# EAGLE design conv_smd_new (EAGLE 6.1)
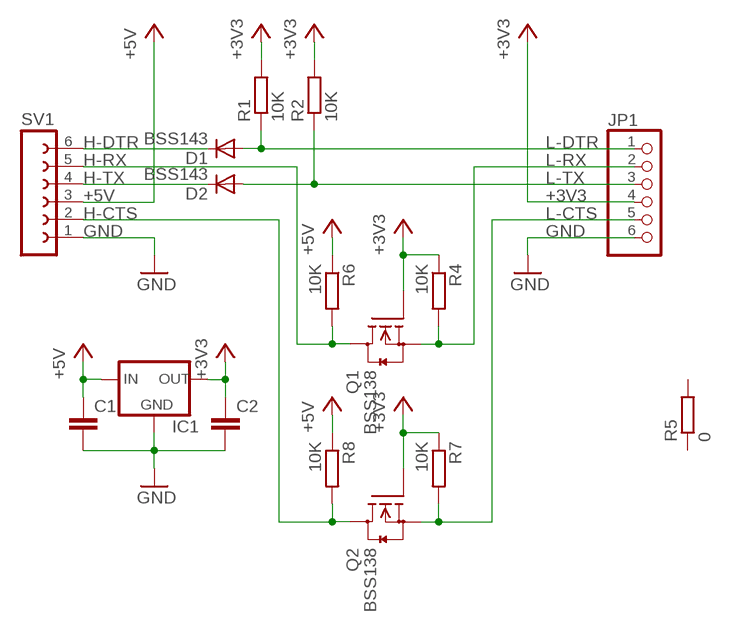
[diagram p0: schematic, sheet 1]

## Parts
C1  C-EUC0805  [C0805]
C2  C-EUC0805  [C0805]
D1  BSS143  DIODE-SOD80C  [SOD80C]
D2  BSS143  DIODE-SOD80C  [SOD80C]
IC1  MCP1700_SOT-32  [SOT23]
JP1  PINHD-1X6/90  [1X06/90]
Q1  BSS138  [SOT23]
Q2  BSS138  [SOT23]
R1  10K  R-EU_M0805  [M0805]
R2  10K  R-EU_M0805  [M0805]
R4  10K  R-EU_M0805  [M0805]
R5  0  R-EU_M1206  [M1206]
R6  10K  R-EU_M0805  [M0805]
R7  10K  R-EU_M0805  [M0805]
R8  10K  R-EU_M0805  [M0805]
SV1  FE06W  [FE06W]

## Nets
+3V3: C2.1 IC1.2(OUT) JP1.4 Q1.1(G) Q2.1(G) R1.2 R2.2 R4.1 R7.1
+5V: C1.1 IC1.3(IN) R6.1 R8.1 SV1.3
GND: C1.2 C2.2 IC1.1(GND) JP1.6 SV1.1
H-CTS: Q2.3(D) R8.2 SV1.2
H-DTR: D1.C SV1.6
H-RX: Q1.3(D) R6.2 SV1.5
H-TX: D2.C SV1.4
L-CTS: JP1.5 Q2.2(S) R7.2
L-DTR: D1.A JP1.1 R1.1
L-RX: JP1.2 Q1.2(S) R4.2
L-TX: D2.A JP1.3 R2.1
Unconnected: R5.1 R5.2

## Library data of the parts
C1 C2 = rcl:C-EU: CAPACITOR, European symbol
D1 D2 = diode:DIODE-: DIODE
IC1 = _MY_OWN_LIB:MCP1700: VOLTAGE REGULATOR
JP1 = pinhead:PINHD-1X6: PIN HEADER
Q1 Q2 = m-pad-2.1:BSS138: Fairchild Semiconductors BSS138 N-Channel Logic Level Enhancement Mode Field Effect Transistor General Description: These N-Channel enhancement mode field effect transistors are produced using Fairchild's proprietary, high cell density, DMOS technology. These products have been designed to minimize on-state resistance while provide rugged, reliable, and fast switching performance.These products are particularly suited for low voltage, low current applications such as small servo motor control, power MOSFET gate drivers, and other switching applications. Features: 0.22 A, 50 V. RDS(ON) = 3.5Ohm @ VGS = 10 V RDS(ON) = 6.0Ohm @ VGS = 4.5 V High density cell design for extremely low RDS(ON) Rugged and Reliable Compact industry standard SOT-23 surface mount package Please send any comments to: messi@users.sourceforge.net
R1 R2 R4-R8 = rcl:R-EU_: RESISTOR, European symbol
SV1 = con-lsta:FE06W: FEMALE HEADER; OC_FARNELL: unknown; OC_NEWARK: unknown

## Board
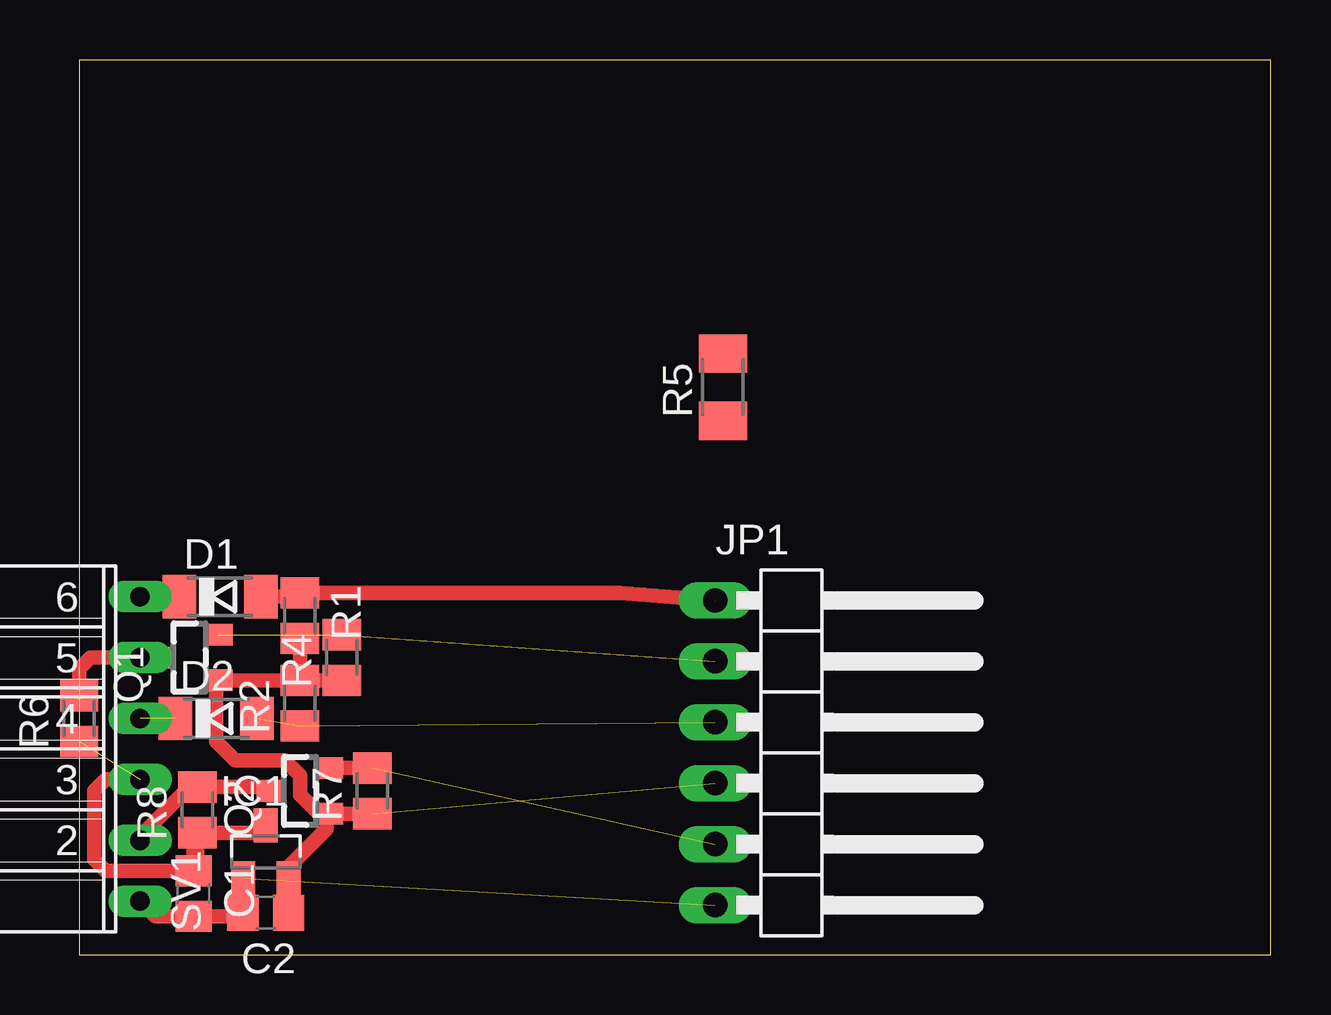
[diagram p1: board, top side]

Size 49.67 x 37.29 mm. Coordinates in mm from the lower left corner, seen from the top.
Outline: 0,0 49.67,0 49.67,37.29 0,37.29 0,0
Copper layers (1*16): Top 0.035mm / dielectric 1.5mm / Bottom 0.035mm
Design rules: minimum track width 10mil, minimum drill 24mil, track to track 8mil, track to pad 8mil, pad to pad 8mil, via to via 8mil, smd to smd 8mil, copper to edge 40mil, drill to drill 8mil, minimum pad ring 10mil, minimum via ring 8mil, stop-mask expansion 4mil, vias tented up to drill 0mil, thermal gap 10mil

### Footprints (pad centres in the part's own frame; a part is rotated, then mirrored left to right if it is on the bottom)
C0805 = smd 1.3 x 1.5: 1 -0.95,0; 2 0.95,0
SOD80C = smd 1.4 x 1.8: A 1.7,0; C -1.7,0
SOT23 = smd 1 x 1.4: 1 -0.95,-1.1; 2 0.95,-1.1; 3 0,1.1
1X06/90 = drill 1.016 long: 1 -6.35,-3.81; 2 -3.81,-3.81; 3 -1.27,-3.81; 4 1.27,-3.81; 5 3.81,-3.81; 6 6.35,-3.81
SOT23' = smd 0.9 x 1.2: 1 -0.95,-1.2; 2 0.95,-1.2; 3 0,1.2
M0805 = smd 1.3 x 1.6: 1 -0.95,0; 2 0.95,0
M1206 = smd 1.6 x 2: 1 -1.4,0; 2 1.4,0
FE06W = drill 0.813 long: 1 -6.35,0; 2 -3.81,0; 3 -1.27,0; 4 1.27,0; 5 3.81,0; 6 6.35,0

### Placement (x,y rotation side)
C1  4.76,2.54 270 top
C2  7.78,1.75 180 top
D1  5.87,14.92 0 top
D2  5.71,9.84 0 top
IC1  7.78,4.29 0 top
JP1  30.32,8.41 270 top
Q1  BSS138  [SOT23']  4.6,12.38 90 top
Q2  BSS138  [SOT23']  9.21,6.83 90 top
R1  9.21,14.13 270 top
R2  9.21,10.48 90 top
R4  10.95,12.38 90 top
R5  26.83,23.65 90 top
R6  0,9.84 90 top
R7  12.22,6.83 90 top
R8  4.92,6.03 90 top
SV1  2.54,8.57 90 top

### Tracks (layer width: path | path; a pad name or v marks a point on that pad's centre or on a via)
+3V3  (1 unrouted)
  Top 0.61: C2.1 IC1.2 8.73,3.65 10.32,5.24 10.32,5.79 Q2.1 | Q2.1 R7.1 | Q2.1 10,5.88 9.21,6.67 9.21,7.46 8.57,8.1 6.51,8.1 5.71,8.89 5.71,11.34 Q1.1 R2.2 | R2.2 R4.1 | R2.2 R1.2
+5V  (1 unrouted)
  Top 0.61: C1.1 4.76,4.92 R8.1 | R8.1 7.47,5.08 IC1.3 | R8.1 4.92,3.49 | 4.76,3.33 4.92,3.49 | 4.92,3.49 1.11,3.49 0.64,3.97 0.64,6.83 1.11,7.3 SV1.3
GND  (1 unrouted)
  Top 0.61: SV1.1 3.17,1.59 C1.2 6.67,1.59 C2.2 | C2.2 6.83,1.59 | C2.2 | 6.83,3.17 C2.2 | C2.2 IC1.1
H-CTS
  Top 0.61: Q2.3 7.85,6.98 R8.2 4.76,6.83 4.45,6.83 2.54,4.92 SV1.2
H-DTR
  Top 0.61: SV1.6 D1.C
H-RX
  Top 0.61: R6.2 0,11.91 0.48,12.38 SV1.5 Q1.3
H-TX  (1 unrouted)
L-CTS  (1 unrouted)
  Top 0.61: R7.2 Q2.2
L-DTR  (1 unrouted)
  Top 0.61: D1.A 9.05,14.92 R1.1 22.54,15.08 JP1.1
L-RX  (2 unrouted)
L-TX  (2 unrouted)